# EAGLE schematic schematic (EAGLE 6.5.0)
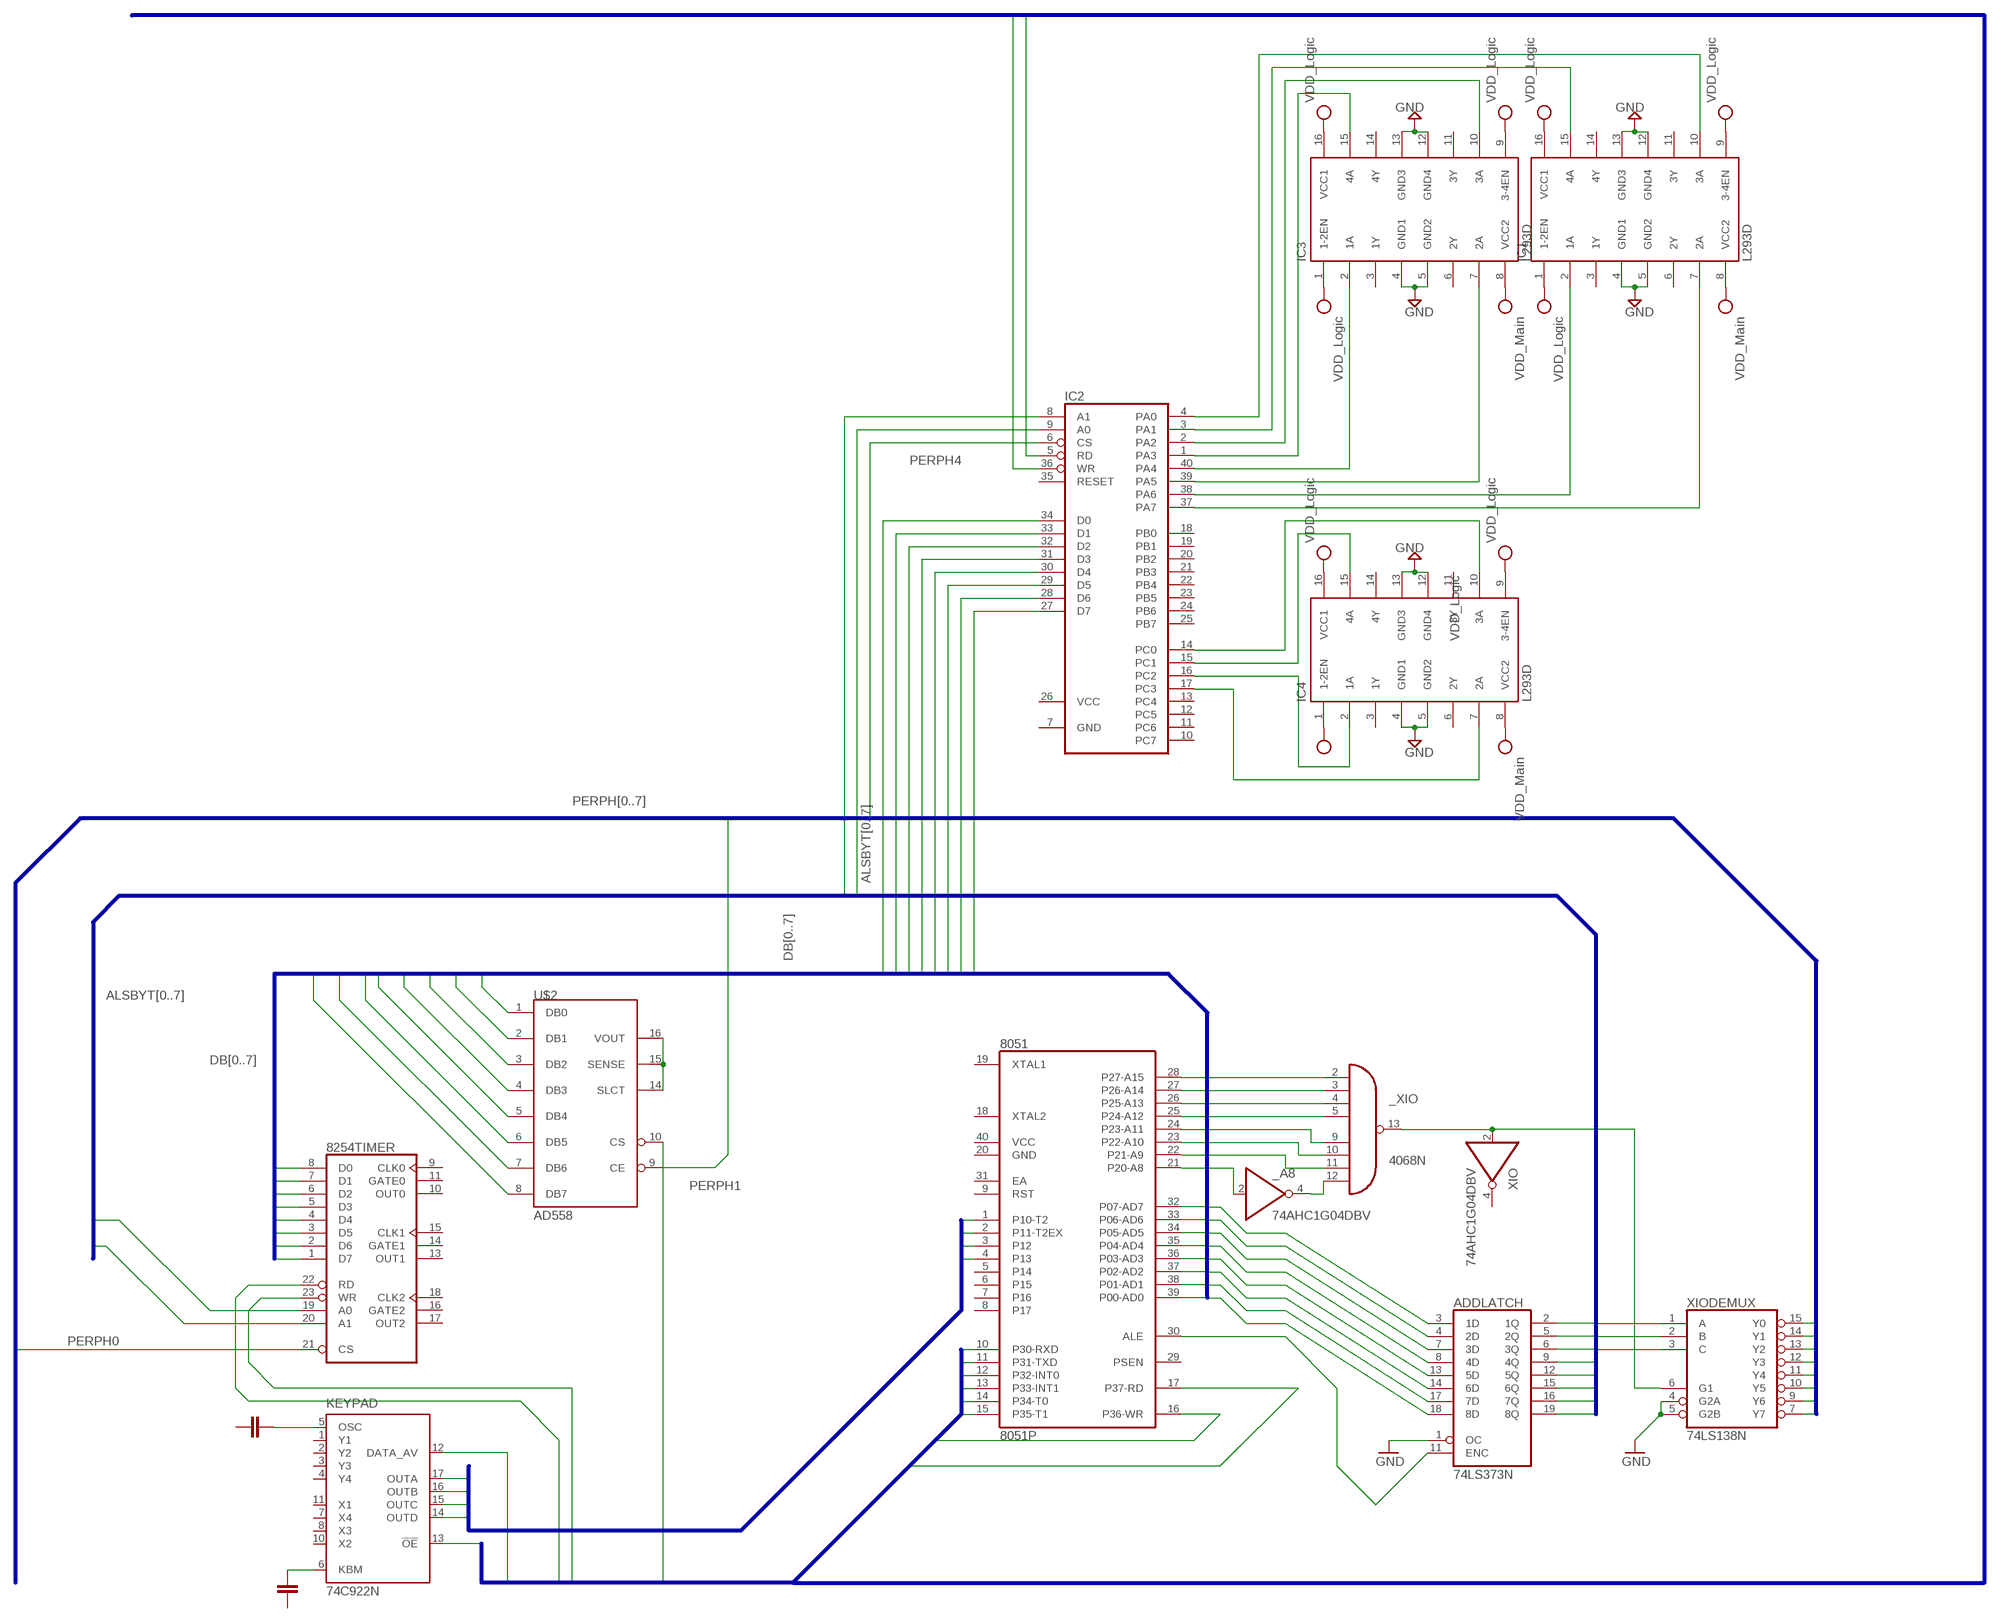
[diagram p0: schematic, sheet 1]

## Parts
8051  8051P  [DIL40]
8254TIMER  8253  [DIL24-6]
_A8  74AHC1G04DBV  [SOT23-5]
_XIO  4068N  [DIL14]
ADDLATCH  74LS373N  [DIL20]
IC1  L293D  [DIL16]
IC2  82C55A  [DIL40]
IC3  L293D  [DIL16]
IC4  L293D  [DIL16]
KEYPAD  74C922N  [DIL18]
U$2  AD558  [DIL16]
XIO  74AHC1G04DBV  [SOT23-5]
XIODEMUX  74LS138N  [DIL16]

## Nets
ALSBYT0: 8254TIMER.19(A0) ADDLATCH.19(8Q) IC2.9(A0)
ALSBYT1: 8254TIMER.20(A1) ADDLATCH.16(7Q) IC2.8(A1)
ALSBYT2: ADDLATCH.15(6Q)
ALSBYT3: ADDLATCH.12(5Q) XIODEMUX.1(A)
ALSBYT4: ADDLATCH.9(4Q) XIODEMUX.2(B)
ALSBYT5: ADDLATCH.6(3Q) XIODEMUX.3(C)
ALSBYT6: ADDLATCH.5(2Q)
ALSBYT7: ADDLATCH.2(1Q)
DB0: 8051.39(P00-AD0) 8254TIMER.8(D0) ADDLATCH.18(8D) IC2.34(D0) U$2.1(DB0)
DB1: 8051.38(P01-AD1) 8254TIMER.7(D1) ADDLATCH.17(7D) IC2.33(D1) U$2.2(DB1)
DB2: 8051.37(P02-AD2) 8254TIMER.6(D2) ADDLATCH.14(6D) IC2.32(D2) U$2.3(DB2)
DB3: 8051.36(P03-AD3) 8254TIMER.5(D3) ADDLATCH.13(5D) IC2.31(D3) U$2.4(DB3)
DB4: 8051.35(P04-AD4) 8254TIMER.4(D4) ADDLATCH.8(4D) IC2.30(D4) U$2.5(DB4)
DB5: 8051.34(P05-AD5) 8254TIMER.3(D5) ADDLATCH.7(3D) IC2.29(D5) U$2.6(DB5)
DB6: 8051.33(P06-AD6) 8254TIMER.2(D6) ADDLATCH.4(2D) IC2.28(D6) U$2.7(DB6)
DB7: 8051.32(P07-AD7) 8254TIMER.1(D7) ADDLATCH.3(1D) IC2.27(D7) U$2.8(DB7)
GND: ADDLATCH.1(OC) IC1.4(GND1) IC1.5(GND2) IC1.12(GND4) IC1.13(GND3) IC3.4(GND1) IC3.5(GND2) IC3.12(GND4) IC3.13(GND3) IC4.4(GND1) IC4.5(GND2) IC4.12(GND4) IC4.13(GND3) XIODEMUX.4(G2A) XIODEMUX.5(G2B)
N$1: KEYPAD.5(OSC)
N$2: KEYPAD.6(KBM)
N$3: 8051.28(P27-A15) _XIO.2(I0)
N$4: 8051.27(P26-A14) _XIO.3(I1)
N$5: 8051.26(P25-A13) _XIO.4(I2)
N$6: 8051.25(P24-A12) _XIO.5(I3)
N$7: 8051.24(P23-A11) _XIO.9(I4)
N$8: 8051.23(P22-A10) _XIO.10(I5)
N$9: 8051.22(P21-A9) _XIO.11(I6)
N$10: 8051.21(P20-A8) _A8.2(I)
N$11: _XIO.13(J) XIO.2(I) XIODEMUX.6(G1)
N$12: _A8.4(O) _XIO.12(I7)
N$13: 8051.30(ALE) ADDLATCH.11(ENC)
N$14: IC2.15(PC1) IC4.15(4A)
N$15: U$2.14(SLCT) U$2.15(SENSE) U$2.16(VOUT)
N$16: IC2.14(PC0) IC4.10(3A)
N$17: IC2.16(PC2) IC4.2(1A)
N$18: IC2.17(PC3) IC4.7(2A)
N$19: IC1.7(2A) IC2.37(PA7)
N$20: IC1.2(1A) IC2.38(PA6)
N$21: IC2.39(PA5) IC3.7(2A)
N$22: IC2.40(PA4) IC3.2(1A)
N$23: IC2.1(PA3) IC3.15(4A)
N$24: IC2.2(PA2) IC3.10(3A)
N$25: IC1.15(4A) IC2.3(PA1)
N$26: IC1.10(3A) IC2.4(PA0)
P_ONE0: 8051.1(P10-T2) KEYPAD.17(OUTA)
P_ONE1: 8051.2(P11-T2EX) KEYPAD.16(OUTB)
P_ONE2: 8051.3(P12) KEYPAD.15(OUTC)
P_ONE3: 8051.4(P13) KEYPAD.14(OUTD)
P_THREE0: 8051.10(P30-RXD)
P_THREE1: 8051.11(P31-TXD)
P_THREE2: 8051.12(P32-INT0) KEYPAD.13(!OE)
P_THREE3: 8051.13(P33-INT1) KEYPAD.12(DATA_AV)
P_THREE4: 8051.14(P34-T0)
P_THREE5: 8051.15(P35-T1)
P_THREE6: 8051.16(P36-WR) 8254TIMER.23(WR) IC2.36(WR) U$2.10(CS)
P_THREE7: 8051.17(P37-RD) 8254TIMER.22(RD) IC2.5(RD)
PERPH0: 8254TIMER.21(CS) XIODEMUX.15(Y0)
PERPH1: U$2.9(CE) XIODEMUX.14(Y1)
PERPH2: XIODEMUX.13(Y2)
PERPH3: XIODEMUX.12(Y3)
PERPH4: IC2.6(CS) XIODEMUX.11(Y4)
PERPH5: XIODEMUX.10(Y5)
PERPH6: XIODEMUX.9(Y6)
PERPH7: XIODEMUX.7(Y7)
VDD: IC1.1(1-2EN) IC1.8(VCC2) IC1.9(3-4EN) IC1.16(VCC1) IC3.1(1-2EN) IC3.8(VCC2) IC3.9(3-4EN) IC3.16(VCC1) IC4.1(1-2EN) IC4.8(VCC2) IC4.9(3-4EN) IC4.16(VCC1) ; supply symbol labelled VDD_Main, VDD_Logic
Unconnected: 8051.5(P14) 8051.6(P15) 8051.7(P16) 8051.8(P17) 8051.9(RST) 8051.18(XTAL2) 8051.19(XTAL1) 8051.29(PSEN) 8051.31(EA) 8254TIMER.9(CLK0) 8254TIMER.10(OUT0) 8254TIMER.11(GATE0) 8254TIMER.13(OUT1) 8254TIMER.14(GATE1) 8254TIMER.15(CLK1) 8254TIMER.16(GATE2) 8254TIMER.17(OUT2) 8254TIMER.18(CLK2) IC1.3(1Y) IC1.6(2Y) IC1.11(3Y) IC1.14(4Y) IC2.10(PC7) IC2.11(PC6) IC2.12(PC5) IC2.13(PC4) IC2.18(PB0) IC2.19(PB1) IC2.20(PB2) IC2.21(PB3) IC2.22(PB4) IC2.23(PB5) IC2.24(PB6) IC2.25(PB7) IC2.35(RESET) IC3.3(1Y) IC3.6(2Y) IC3.11(3Y) IC3.14(4Y) IC4.3(1Y) IC4.6(2Y) IC4.11(3Y) IC4.14(4Y) KEYPAD.1(Y1) KEYPAD.2(Y2) KEYPAD.3(Y3) KEYPAD.4(Y4) KEYPAD.7(X4) KEYPAD.8(X3) KEYPAD.10(X2) KEYPAD.11(X1) XIO.4(O)

## Buses
P_ONE[0..7]
P_THREE[0..7]
DB[0..7]
ALSBYT[0..7]
PERPH[0..7]

## Power pins joined to a net without a drawn wire
GND: 8051.20(GND) 8254TIMER.12(GND) _A8.3(GND) ADDLATCH.10(GND) IC2.7(GND) KEYPAD.9(GND) U$2.12(GND) XIO.3(GND) XIODEMUX.8(GND)
GND2: U$2.13(GND2)
VCC: 8051.40(VCC) 8254TIMER.24(VCC) _A8.5(VCC) ADDLATCH.20(VCC) IC2.26(VCC) KEYPAD.18(VCC) U$2.11(VCC) XIO.5(VCC) XIODEMUX.16(VCC)
VDD: _XIO.14(VDD)
VSS: _XIO.7(VSS)

## Library data of the parts
8051 = micro-intel:8051: (CHMOS) SINGLE-CHIP 8-BIT MICROCONTROLLER 80C31BH / 80C51 BH / 87C51 MCS 51 Source: http://apps.intel.com .. 27041907.pdf; OC_FARNELL: unknown; OC_NEWARK: unknown
8254TIMER = micro-intel:8253: MICROCOMPUTER/PERIPHERAL DEVICE; OC_FARNELL: unknown; OC_NEWARK: unknown
_A8 XIO = 74xx-little-de:74*1G04: INVERTER Gate
_XIO = 40xx:4068: 8-input NAND
ADDLATCH = 74xx-us:74*373: Octal D type transparent LATCH, edge triggered
IC1 IC3 IC4 = st-microelectronics:L293D: PUSH-PULL 4 CHANNEL DRIVER; MPN: L293D; OC_FARNELL: 9589619; OC_NEWARK: 56P8249
IC2 = micro-intel:82C55A: MICROCOMPUTER/PERIPHERAL DEVICE; MF: INTERSIL; MPN: IP82C55AZ; OC_FARNELL: 1562050; OC_NEWARK: 79K6939
KEYPAD = 74xx-us:74C922: 16-Key Encoder Source: http://www.national.com/ds/MM/MM54C922.pdf#page=1
U$2 = AD558:AD558: Voltage-output 8-bit digital-to-analog converter The AD558 DACPORT is a complete voltage-output 8-bit digital-to-analog converter, including output amplifier, full microprocessor interface and precision voltage reference on a single monolithic chip. No external components or trims are required to interface, with full accuracy, an 8-bit data bus to an analog system.
XIODEMUX = 74xx-us:74*138: 3-line to 8-line DECODER/DEMULTIPLEXER